# Altium schematic sheet Ecg.SchDoc
size A2
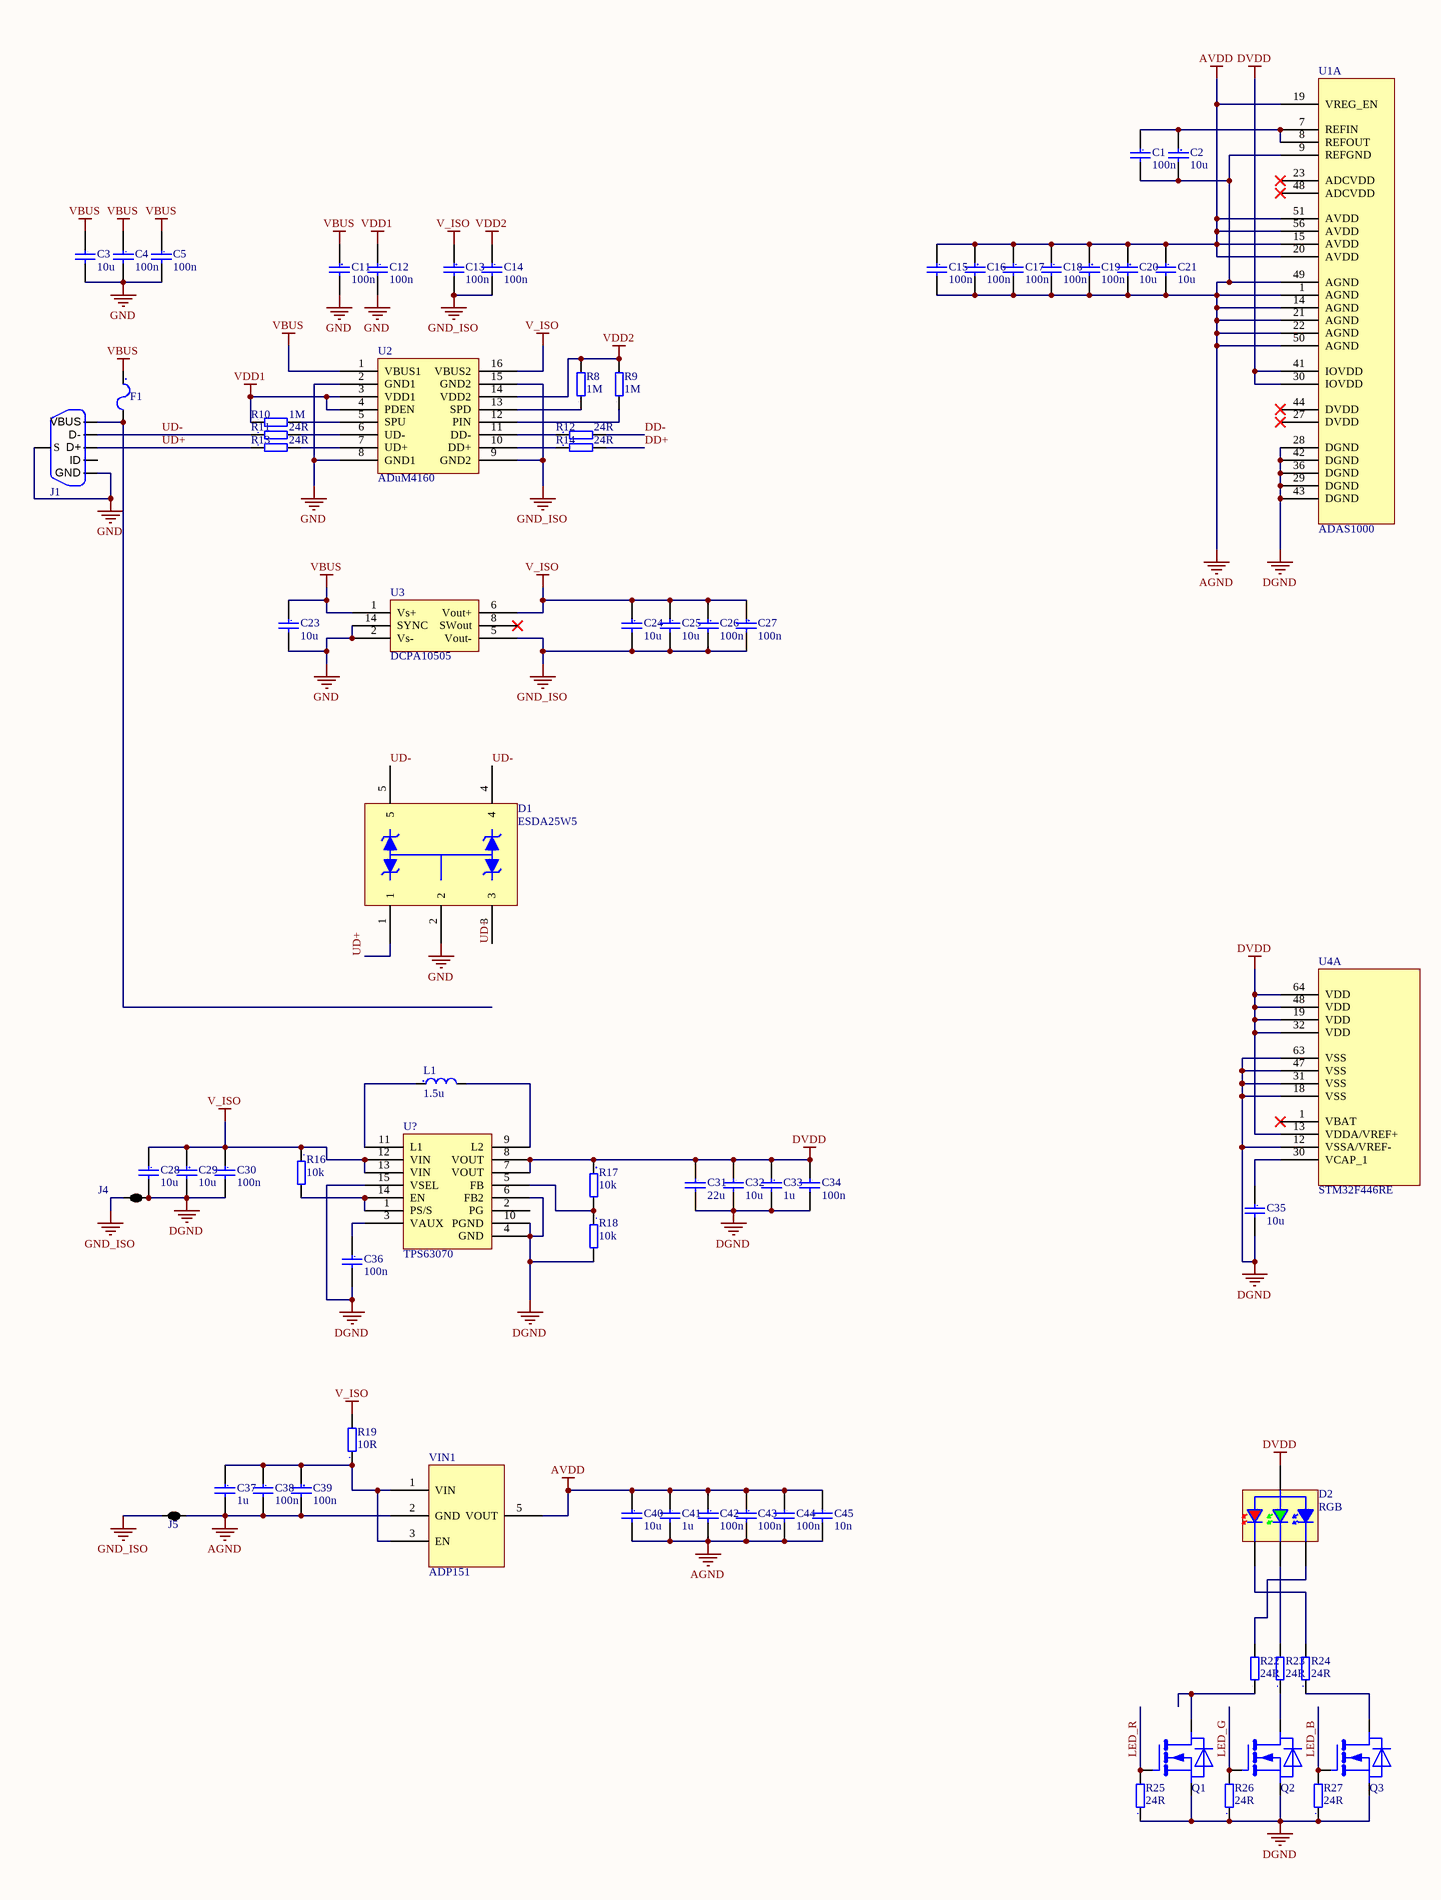
[diagram p0: Ecg.SchDoc, left]
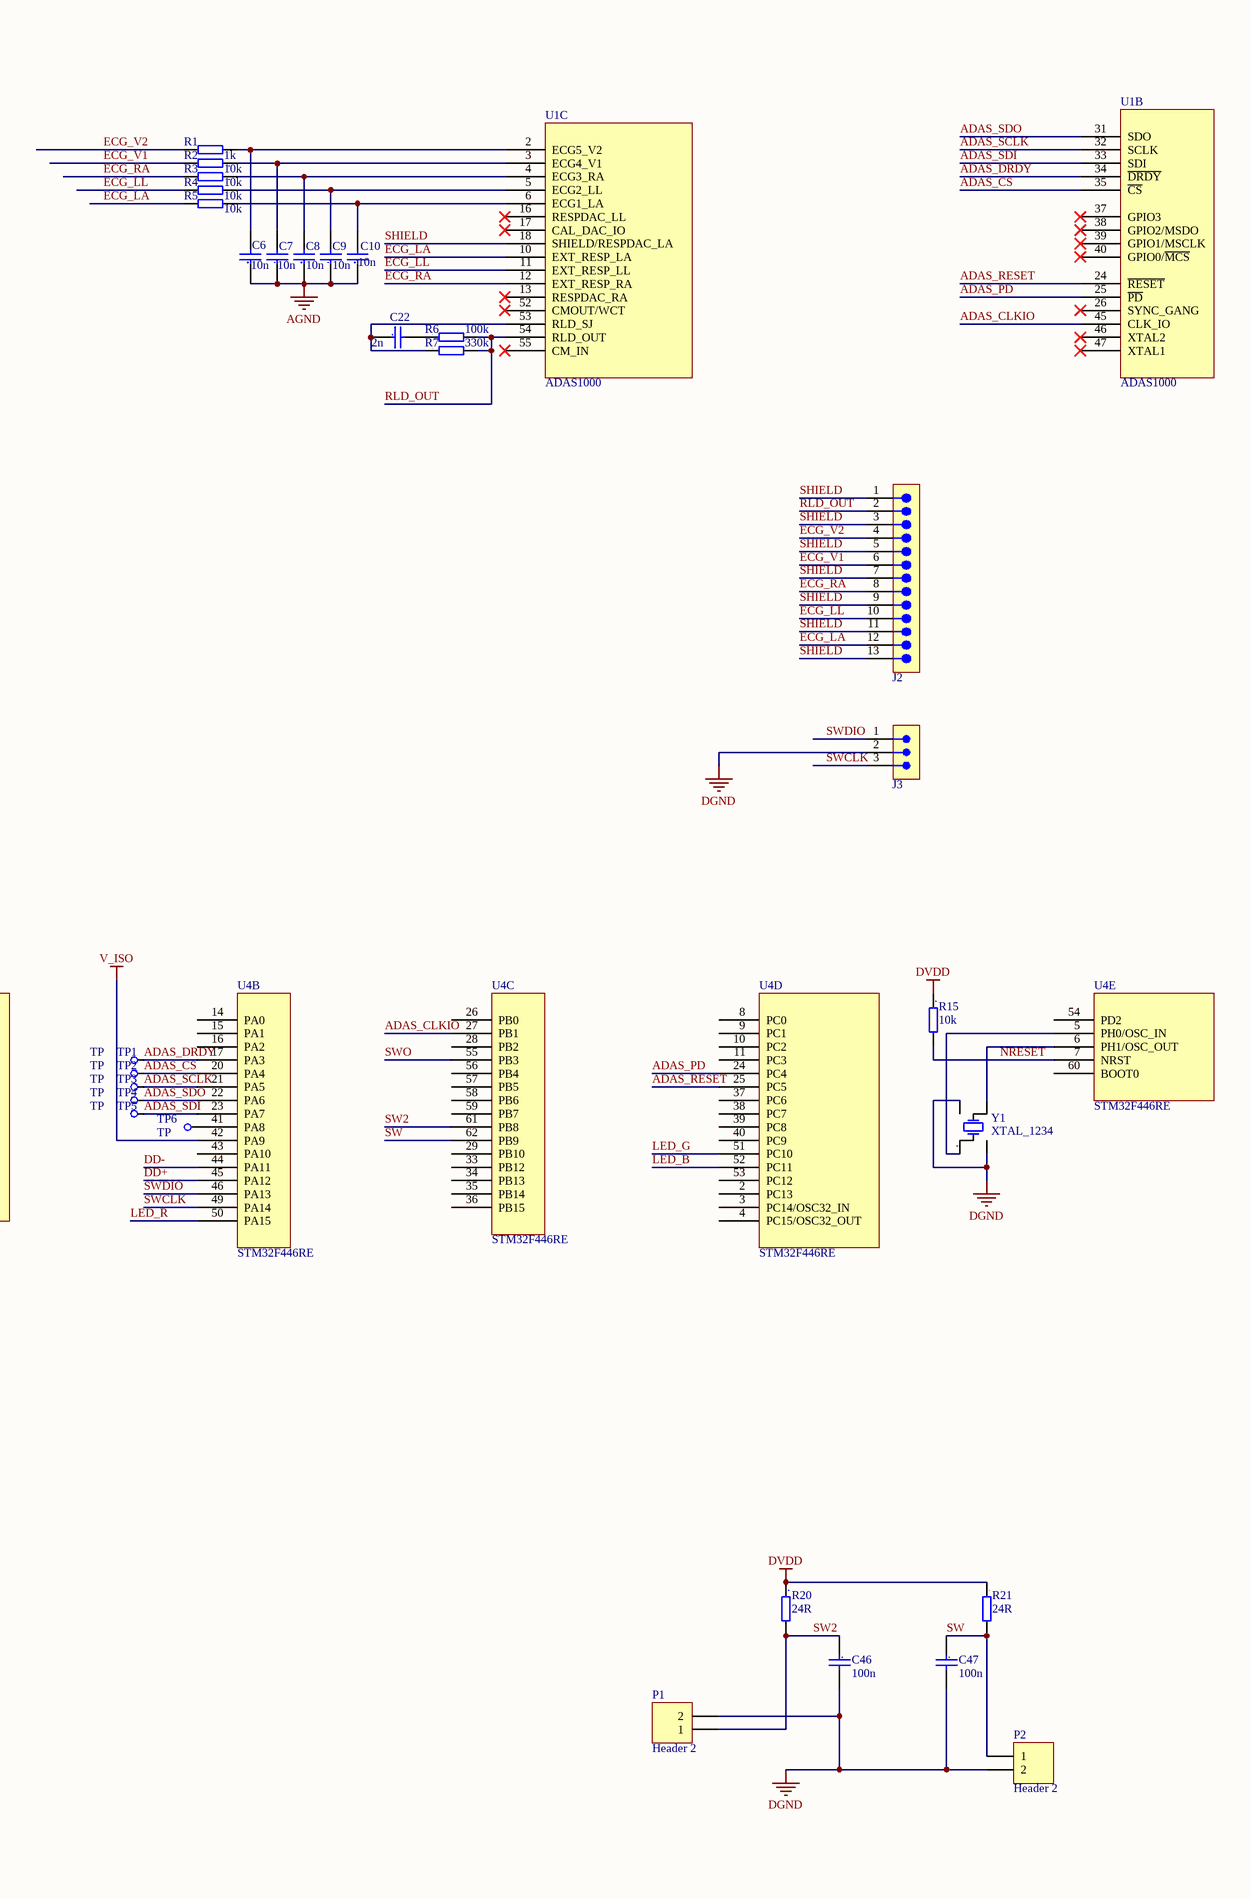
[diagram p1: Ecg.SchDoc, right]

## Parts
C1  100n  [C0402_N]
C2  10u  [C0603_N]
C3  10u  [C0805_N]
C4  100n  [C0402_N]
C5  100n  [C0402_N]
C6  10n  [C0603_N]
C7  10n  [C0603_N]
C8  10n  [C0603_N]
C9  10n  [C0603_N]
C10  10n  [C0603_N]
C11  100n  [C0402_N]
C12  100n  [C0402_N]
C13  100n  [C0402_N]
C14  100n  [C0402_N]
C15  100n  [C0402_N]
C16  100n  [C0402_N]
C17  100n  [C0402_N]
C18  100n  [C0402_N]
C19  100n  [C0402_N]
C20  10u  [C0603_N]
C21  10u  [C0603_N]
C22  2n  [C0603_N]
C23  10u  [C0805_N]
C24  10u  [C0805_N]
C25  10u  [C0805_N]
C26  100n  [C0402_N]
C27  100n  [C0402_N]
C28  10u  [C0603_N]
C29  10u  [C0603_N]
C30  100n  [C0402_N]
C31  22u  [C0603_N]
C32  10u  [C0603_N]
C33  1u  [C0603_N]
C34  100n  [C0603_N]
C35  10u  [C0603_N]
C36  100n  [C0402_N]
C37  1u  [C0603_N]
C38  100n  [C0402_N]
C39  100n  [C0402_N]
C40  10u  [C0603_N]
C41  1u  [C0603_N]
C42  100n  [C0402_N]
C43  100n  [C0402_N]
C44  100n  [C0402_N]
C45  10n  [C0402_N]
C46  100n  [C0402_N]
C47  100n  [C0402_N]
D1  ESDA25W5  [SOT353_12345]
D2  RGB  [LED3528_RGB]
F1  FUSE  [FUSE1210]  (value not drawn)
J1  USB_OTG  [WR-COM-629105136821]  (value not drawn)
J2  (no value)  [B13B-XH-A]
J3  (no value)  [B3B-XH-A]
J4  2 way net tie junction  [2way_HP]  (value not drawn)  (net tie, no BOM)
J5  2 way net tie junction  [2way_HP]  (value not drawn)  (net tie, no BOM)
L1  1.5u  [IHLP2020]
P1  Header 2  [HDR1X2]
P2  Header 2  [HDR1X2]
Q1  MOSFET_N  [SOT23_123_N]  (value not drawn)
Q2  MOSFET_N  [SOT23_123_N]  (value not drawn)
Q3  MOSFET_N  [SOT23_123_N]  (value not drawn)
R1  1k  [R0603_N]
R2  10k  [R0603_N]
R3  10k  [R0603_N]
R4  10k  [R0603_N]
R5  10k  [R0603_N]
R6  100k  [R0603_N]
R7  330k  [R0603_N]
R8  1M  [R0402_N]
R9  1M  [R0402_N]
R10  1M  [R0402_N]
R11  24R  [R0402_N]
R12  24R  [R0402_N]
R13  24R  [R0402_N]
R14  24R  [R0402_N]
R15  10k  [R0402_N]
R16  10k  [R0402_N]
R17  10k  [R0402_N]
R18  10k  [R0402_N]
R19  10R  [R0603_N]
R20  24R  [R0402_N]
R21  24R  [R0402_N]
R22  24R  [R0402_N]
R23  24R  [R0402_N]
R24  24R  [R0402_N]
R25  24R  [R0402_N]
R26  24R  [R0402_N]
R27  24R  [R0402_N]
TP1  TP  [TP_1MM]  (no BOM)
TP2  TP  [TP_1MM]  (no BOM)
TP3  TP  [TP_1MM]  (no BOM)
TP4  TP  [TP_1MM]  (no BOM)
TP5  TP  [TP_1MM]  (no BOM)
TP6  TP  [TP_1MM]  (no BOM)
U1  ADAS1000  [LFCSP-56]  (parts A,B,C of 3)
U2  ADuM4160  [SOIC-16 Wide]
U3  DCPA10505  [SOP-14 (isolator)]
U4  STM32F446RE  [LQFP64]  (parts A,B,C,D,E of 5)
U?  TPS63070  [RNM0015A]
VIN1  ADP151  [SOT23-5]
Y1  XTAL_1234  [3225_N]

## Nets
AGND: C1.2 C2.2 C6.1 C7.1 C8.1 C9.1 C10.1 C15.2 C16.2 C17.2 C18.2 C19.2 C20.2 C21.2 C37.2 C38.2 C39.2 C40.2 C41.2 C42.2 C43.2 C44.2 C45.2 J5.2 U1.1(AGND) U1.9(REFGND) U1.14(AGND) U1.21(AGND) U1.22(AGND) U1.49(AGND) U1.50(AGND) VIN1.2(GND)
AVDD: C15.1 C16.1 C17.1 C18.1 C19.1 C20.1 C21.1 C40.1 C41.1 C42.1 C43.1 C44.1 C45.1 U1.15(AVDD) U1.19(VREG_EN) U1.20(AVDD) U1.51(AVDD) U1.56(AVDD) VIN1.5(VOUT)
DGND: C28.2 C29.2 C30.2 C31.2 C32.2 C33.2 C34.2 C35.2 C36.2 C46.2 C47.2 J3.2 J4.2 P1.2 P2.2 Q1.S Q2.S Q3.S R18.2 R25.1 R26.1 R27.1 U1.28(DGND) U1.29(DGND) U1.36(DGND) U1.42(DGND) U1.43(DGND) U4.12(VSSA/VREF-) U4.18(VSS) U4.31(VSS) U4.47(VSS) U4.63(VSS) U?.4(GND) U?.6(FB2) U?.10(PGND) U?.15(VSEL) Y1.2 Y1.4
DVDD: C31.1 C32.1 C33.1 C34.1 D2.A R15.1 R17.1 R20.1 R21.1 U1.30(IOVDD) U1.41(IOVDD) U4.13(VDDA/VREF+) U4.19(VDD) U4.32(VDD) U4.48(VDD) U4.64(VDD) U?.7(VOUT) U?.8(VOUT)
GND: C3.2 C4.2 C5.2 C11.2 C12.2 C23.2 D1.2 J1.GND J1.S U2.2(GND1) U2.8(GND1) U3.2(Vs-) U3.14(SYNC)
GND_ISO: C13.2 C14.2 C24.2 C25.2 C26.2 C27.2 J4.1 J5.1 U2.9(GND2) U2.15(GND2) U3.5(Vout-)
V_ISO: C13.1 C24.1 C25.1 C26.1 C27.1 C28.1 C29.1 C30.1 R16.1 R19.2 U2.16(VBUS2) U3.6(Vout+) U4.42(PA9) U?.12(VIN) U?.13(VIN)
VBUS: C3.1 C4.1 C5.1 C11.1 C23.1 F1.1 U2.1(VBUS1) U3.1(Vs+)
VDD1: C12.1 R10.1 U2.3(VDD1) U2.4(PDEN)
VDD2: C14.1 R8.2 R9.2 U2.14(VDD2)
ADAS_CLKIO: U1.45(CLK_IO) U4.27(PB1)
ADAS_CS: TP2.1 U1.35(~{CS}) U4.20(PA4)
ADAS_DRDY: TP1.1 U1.34(~{DRDY}) U4.17(PA3)
ADAS_PD: U1.25(~{PD}) U4.24(PC4)
ADAS_RESET: U1.24(~{RESET}) U4.25(PC5)
ADAS_SCLK: TP3.1 U1.32(SCLK) U4.21(PA5)
ADAS_SDI: TP5.1 U1.33(SDI) U4.23(PA7)
ADAS_SDO: TP4.1 U1.31(SDO) U4.22(PA6)
DD+: R14.2 U4.45(PA12)
DD-: R12.2 U4.44(PA11)
ECG_LA: J2.12 R5.2 U1.10(EXT_RESP_LA)
ECG_LL: J2.10 R4.2 U1.11(EXT_RESP_LL)
ECG_RA: J2.8 R3.2 U1.12(EXT_RESP_RA)
ECG_V1: J2.6 R2.2
ECG_V2: J2.4 R1.2
LED_B: Q3.G R27.2 U4.52(PC11)
LED_G: Q2.G R26.2 U4.51(PC10)
LED_R: Q1.G R25.2 U4.50(PA15)
NRESET: R15.2 U4.7(NRST)
RLD_OUT: J2.2 R6.2 R7.2 U1.54(RLD_OUT)
SHIELD: J2.1 J2.3 J2.5 J2.7 J2.9 J2.11 J2.13 U1.18(SHIELD/RESPDAC_LA)
SW: C47.1 P2.1 R21.2 U4.62(PB9)
SW2: C46.1 P1.1 R20.2 U4.61(PB8)
SWCLK: J3.3 U4.49(PA14)
SWDIO: J3.1 U4.46(PA13)
SWO: U4.55(PB3)
UD+: D1.1 D1.3 J1.D_P(D+) R13.1
UD-: D1.4 D1.5 J1.D_N(D-) R11.1
NetC1_1: C1.1 C2.1 U1.7(REFIN) U1.8(REFOUT)
NetC6_2: C6.2 R1.1 U1.2(ECG5_V2)
NetC7_2: C7.2 R2.1 U1.3(ECG4_V1)
NetC8_2: C8.2 R3.1 U1.4(ECG3_RA)
NetC9_2: C9.2 R4.1 U1.5(ECG2_LL)
NetC10_2: C10.2 R5.1 U1.6(ECG1_LA)
NetC22_1: C22.1 R7.1 U1.53(RLD_SJ)
NetC22_2: C22.2 R6.1
NetC35_1: C35.1 U4.30(VCAP_1)
NetC36_1: C36.1 U?.3(VAUX)
NetC37_1: C37.1 C38.1 C39.1 R19.1 VIN1.1(VIN) VIN1.3(EN)
NetD2_B: D2.B R22.2
NetD2_G: D2.G R23.2
NetD2_R: D2.R R24.2
NetF1_2: F1.2 J1.VBUS
NetL1_1: L1.1 U?.11(L1)
NetL1_2: L1.2 U?.9(L2)
NetQ1_D: Q1.D R22.1
NetQ2_D: Q2.D R23.1
NetQ3_D: Q3.D R24.1
NetR8_1: R8.1 U2.13(SPD)
NetR9_1: R9.1 U2.12(PIN)
NetR10_2: R10.2 U2.5(SPU)
NetR11_2: R11.2 U2.6(UD-)
NetR12_1: R12.1 U2.11(DD-)
NetR13_2: R13.2 U2.7(UD+)
NetR14_1: R14.1 U2.10(DD+)
NetR16_2: R16.2 U?.1(PS/S) U?.14(EN)
NetR17_2: R17.2 R18.1 U?.5(FB)
NetTP6_1: TP6.1 U4.41(PA8)
NetU4_5: U4.5(PH0/OSC_IN) Y1.1
NetU4_6: U4.6(PH1/OSC_OUT) Y1.3

Not connected (* = marked no-connect by the designer): J1 ID; U1 13(RESPDAC_RA)* 16(RESPDAC_LL)* 17(CAL_DAC_IO)* 23(ADCVDD)* 26(SYNC_GANG)* 27(DVDD)* 37(GPIO3)* 38(GPIO2/MSDO)* 39(GPIO1/MSCLK)* 40(GPIO0/~{MCS})* 44(DVDD)* 46(XTAL2)* 47(XTAL1)* 48(ADCVDD)* 52(CMOUT/WCT)* 55(CM_IN)*; U3 8(SWout)*; U4 1(VBAT)* 2(PC13) 3(PC14/OSC32_IN) 4(PC15/OSC32_OUT) 8(PC0) 9(PC1) 10(PC2) 11(PC3) 14(PA0) 15(PA1) 16(PA2) 26(PB0) 28(PB2) 29(PB10) 33(PB12) 34(PB13) 35(PB14) 36(PB15) 37(PC6) 38(PC7) 39(PC8) 40(PC9) 43(PA10) 53(PC12) 54(PD2) 56(PB4) 57(PB5) 58(PB6) 59(PB7) 60(BOOT0); U? 2(PG)

## Library data of the parts
C1-C47 = CAP: RevS: $Rev:: 58        $
D2 = LED_RGB_CANODE
J1 = USB_OTG: USB Connector, With Pegs, Micro USB Type B, USB 2.0, Receptacle, 5 Ways, Surface Mount, Right Angle
J2 = PINHDR_13X1: Header; ComponentLink1Description: Manufacturer; ComponentLink1URL: http://www.we-online.de; ComponentLink2Description: Datasheet; ComponentLink2URL: http://katalog.we-online.de/em/datasheet/691412320002.pdf
J3 = PINHDR_3X1: Socket; ComponentLink1Description: Manufacturer; ComponentLink1URL: http://www.we-online.de; ComponentLink2Description: Datasheet; ComponentLink2URL: http://katalog.we-online.de/em/datasheet/691412320002.pdf
J4 J5 = NetTie_2: ComponentLink1URL: http://www.edatools.cz/addons; ComponentLink1Description: Source; FootprintNote: LP=12mil, MP=40mil, HP=120mil
L1 = IND: Inductor
P1 P2 = Header 2: Header, 2-Pin; LatestRevisionDate: 17-Jul-2002; LatestRevisionNote: Re-released for DXP Platform.; Publisher: Altium Limited
Q1-Q3 = MOSFET_N: pin to pad: D>3 G>1 S>2
R1-R27 = RES
U1 = ADAS1000: Low Power, Five Electrode / Electrocardiogram (ECG) Analog Front End
U? = TPS63070: 2-V to 16-V Buck-Boost Converter With 3.6-A Switch Current